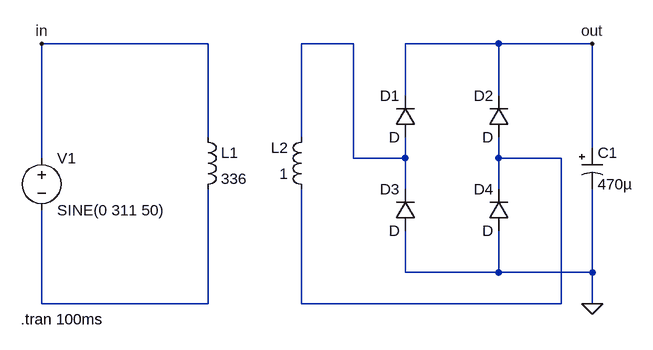
[diagram p0: schematic CASCADED_AC_TO_DC_RECTFIER[1].asc]
CASCADED_AC_TO_DC_RECTFIER[1].asc, the LTspice schematic file:
Version 4.1
SHEET 1 880 680
WIRE -32 -48 -288 -48
WIRE 192 -48 112 -48
WIRE 416 -48 272 -48
WIRE 560 -48 416 -48
WIRE 272 32 272 -48
WIRE 416 32 416 -48
WIRE -32 96 -32 -48
WIRE 112 96 112 -48
WIRE 560 112 560 -48
WIRE -288 128 -288 -48
WIRE 192 128 192 -48
WIRE 272 128 272 96
WIRE 272 128 192 128
WIRE 416 128 416 96
WIRE 512 128 416 128
WIRE 272 176 272 128
WIRE 416 176 416 128
WIRE 272 304 272 240
WIRE 416 304 416 240
WIRE 416 304 272 304
WIRE 560 304 560 176
WIRE 560 304 416 304
WIRE -288 352 -288 208
WIRE -32 352 -32 176
WIRE -32 352 -288 352
WIRE 112 352 112 176
WIRE 512 352 512 128
WIRE 512 352 112 352
WIRE 560 352 560 304
FLAG 560 352 0
FLAG 560 -48 out
FLAG -288 -48 in
SYMBOL diode 288 96 R180
WINDOW 0 24 64 Left 2
WINDOW 3 24 0 Left 2
SYMATTR InstName D1
SYMBOL diode 432 96 R180
WINDOW 0 24 64 Left 2
WINDOW 3 24 0 Left 2
SYMATTR InstName D2
SYMBOL diode 288 240 R180
WINDOW 0 24 64 Left 2
WINDOW 3 24 0 Left 2
SYMATTR InstName D3
SYMBOL diode 432 240 R180
WINDOW 0 24 64 Left 2
WINDOW 3 24 0 Left 2
SYMATTR InstName D4
SYMBOL ind -48 80 R0
SYMATTR InstName L1
SYMATTR Value 336
SYMBOL ind 128 192 R180
WINDOW 0 36 80 Left 2
WINDOW 3 36 40 Left 2
SYMATTR InstName L2
SYMATTR Value 1
SYMBOL voltage -288 112 R0
WINDOW 123 0 0 Left 0
WINDOW 39 0 0 Left 0
SYMATTR InstName V1
SYMATTR Value SINE(0 311 50)
SYMBOL polcap 544 112 R0
SYMATTR InstName C1
SYMATTR Value 470µ
TEXT -320 376 Left 2 !.tran 100ms

The netlist it stands for:
* CASCADED_AC_TO_DC_RECTFIER[1].asc
D1 N001 out D
D2 N002 out D
D3 0 N001 D
D4 0 N002 D
L1 in N003 336
L2 N002 N001 1
V1 in N003 SINE(0 311 50)
C1 out 0 470µ
.model D D
.lib standard.dio
.tran 100ms
.backanno
.end